# Altium project IOExpand.PrjPCB
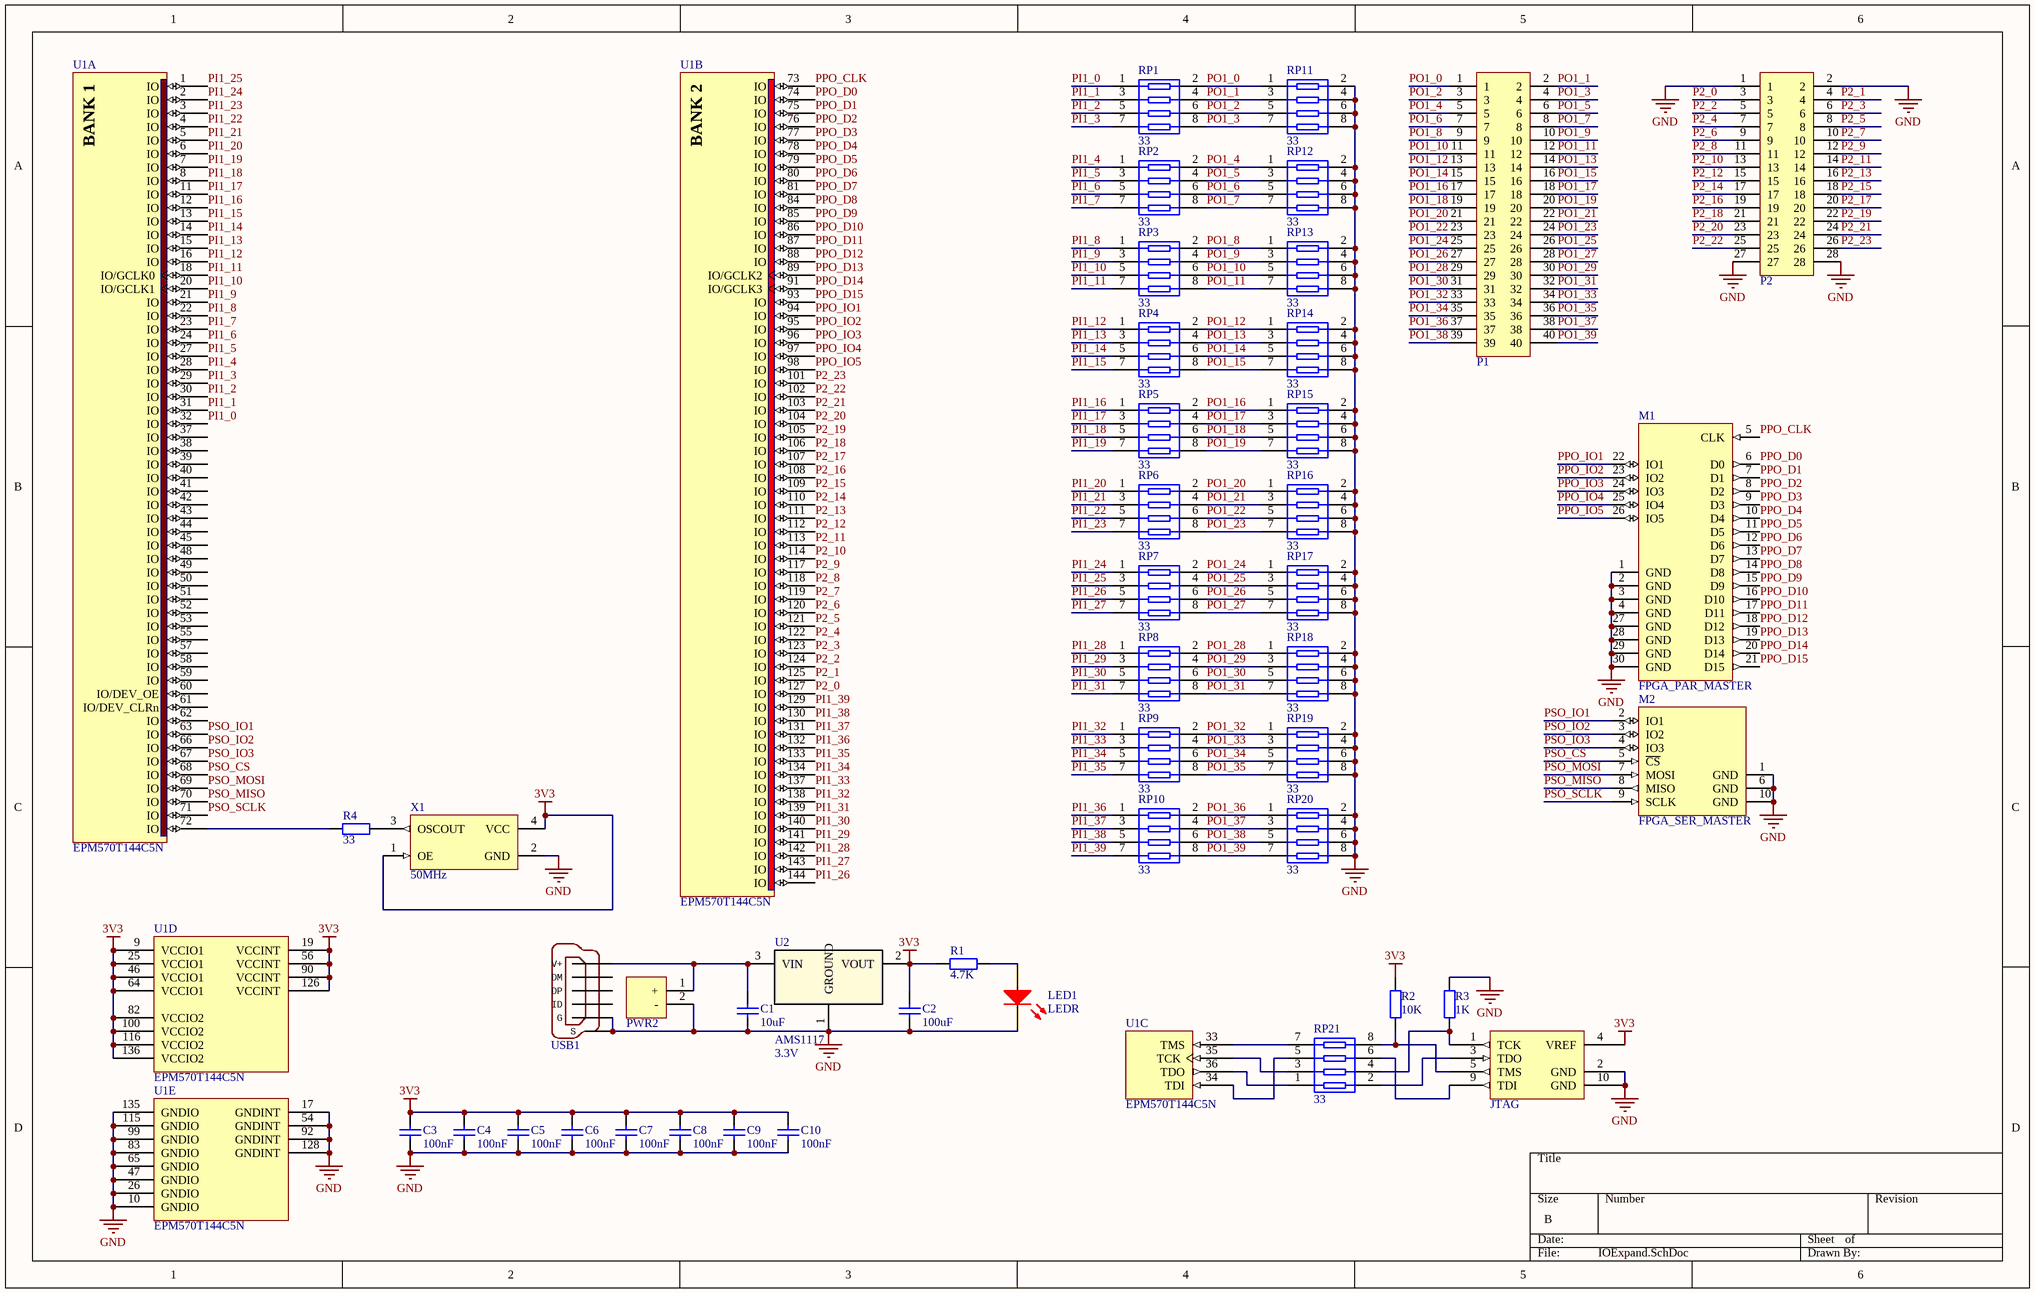
[diagram p0: IOExpand.SchDoc]
1 sheet, 46 parts. Net scope: global (net labels, ports and power ports of the same name join across sheets).
Board file: IOExpand.PcbDoc

## Sheet IOExpand.SchDoc
size B

### Parts
C1  value 10uF  [0805C]  (hidden comment: MLCC)
C2  value 100uF  [1206C]  (hidden comment: MLCC)
C3  value 100nF  [0603C]  (hidden comment: MLCC)
C4  value 100nF  [0603C]  (hidden comment: MLCC)
C5  value 100nF  [0603C]  (hidden comment: MLCC)
C6  value 100nF  [0603C]  (hidden comment: MLCC)
C7  value 100nF  [0603C]  (hidden comment: MLCC)
C8  value 100nF  [0603C]  (hidden comment: MLCC)
C9  value 100nF  [0603C]  (hidden comment: MLCC)
C10  value 100nF  [0603C]  (hidden comment: MLCC)
JTAG  JTAG_ALTERA  [JTAG10]  (value not drawn)
LED1  LEDR  [LED1206R]
M1  FPGA_PAR_MASTER  [IDC30]
M2  FPGA_SER_MASTER  [IDC10]
P1  Dual 20 pin port  [201S2X20]  (value not drawn)
P2  Dual 14 pin port  [201S2X14]  (value not drawn)
PWR2  WPORT2_PWR  [VH3.96-POWER-2P]  (value not drawn)
R1  value 4.7K  [0603R]  (hidden comment: Resistor)
R2  value 10K  [0603R]  (hidden comment: Resistor)
R3  value 1K  [0603R]  (hidden comment: Resistor)
R4  value 33  [0603R]  (hidden comment: Resistor)
RP1  value 33  [8P4R_0603]  (hidden comment: Res Pack)
RP2  value 33  [8P4R_0603]  (hidden comment: Res Pack)
RP3  value 33  [8P4R_0603]  (hidden comment: Res Pack)
RP4  value 33  [8P4R_0603]  (hidden comment: Res Pack)
RP5  value 33  [8P4R_0603]  (hidden comment: Res Pack)
RP6  value 33  [8P4R_0603]  (hidden comment: Res Pack)
RP7  value 33  [8P4R_0603]  (hidden comment: Res Pack)
RP8  value 33  [8P4R_0603]  (hidden comment: Res Pack)
RP9  value 33  [8P4R_0603]  (hidden comment: Res Pack)
RP10  value 33  [8P4R_0603]  (hidden comment: Res Pack)
RP11  value 33  [8P4R_0603]  (hidden comment: Res Pack)
RP12  value 33  [8P4R_0603]  (hidden comment: Res Pack)
RP13  value 33  [8P4R_0603]  (hidden comment: Res Pack)
RP14  value 33  [8P4R_0603]  (hidden comment: Res Pack)
RP15  value 33  [8P4R_0603]  (hidden comment: Res Pack)
RP16  value 33  [8P4R_0603]  (hidden comment: Res Pack)
RP17  value 33  [8P4R_0603]  (hidden comment: Res Pack)
RP18  value 33  [8P4R_0603]  (hidden comment: Res Pack)
RP19  value 33  [8P4R_0603]  (hidden comment: Res Pack)
RP20  value 33  [8P4R_0603]  (hidden comment: Res Pack)
RP21  value 33  [8P4R_0603]  (hidden comment: Res Pack)
U1  EPM570T144C5N  [TQFP144_N]  (parts A,B,C,D,E of 5)
U2  AMS1117  value 3.3V  [DCY4]
USB1  MICRO-USB  [USB-MICRO]  (value not drawn)
X1  value 50MHz  [XTAL-3225]  (hidden comment: Oscillator)

### Nets
3V3: C2.2 C3.2 C4.2 C5.2 C6.2 C7.2 C8.2 C9.2 C10.2 JTAG.4(VREF) R1.1 R2.2 U1.9(VCCIO1) U1.19(VCCINT) U1.25(VCCIO1) U1.46(VCCIO1) U1.56(VCCINT) U1.64(VCCIO1) U1.82(VCCIO2) U1.90(VCCINT) U1.100(VCCIO2) U1.116(VCCIO2) U1.126(VCCINT) U1.136(VCCIO2) U2.2(VOUT) X1.1(OE) X1.4(VCC)
GND: C1.1 C2.1 C3.1 C4.1 C5.1 C6.1 C7.1 C8.1 C9.1 C10.1 JTAG.2(GND) JTAG.10(GND) LED1.2(K) M1.1(GND) M1.2(GND) M1.3(GND) M1.4(GND) M1.27(GND) M1.28(GND) M1.29(GND) M1.30(GND) M2.1(GND) M2.6(GND) M2.10(GND) P2.1 P2.2 P2.27 P2.28 PWR2.2(-) R3.2 RP11.2 RP11.4 RP11.6 RP11.8 RP12.2 RP12.4 RP12.6 RP12.8 RP13.2 RP13.4 RP13.6 RP13.8 RP14.2 RP14.4 RP14.6 RP14.8 RP15.2 RP15.4 RP15.6 RP15.8 RP16.2 RP16.4 RP16.6 RP16.8 RP17.2 RP17.4 RP17.6 RP17.8 RP18.2 RP18.4 RP18.6 RP18.8 RP19.2 RP19.4 RP19.6 RP19.8 RP20.2 RP20.4 RP20.6 RP20.8 U1.10(GNDIO) U1.17(GNDINT) U1.26(GNDIO) U1.47(GNDIO) U1.54(GNDINT) U1.65(GNDIO) U1.83(GNDIO) U1.92(GNDINT) U1.99(GNDIO) U1.115(GNDIO) U1.128(GNDINT) U1.135(GNDIO) U2.1(GROUND) USB1.1(G) USB1.6(S) X1.2(GND)
P2_0: P2.3 U1.127(IO)
P2_1: P2.4 U1.125(IO)
P2_2: P2.5 U1.124(IO)
P2_3: P2.6 U1.123(IO)
P2_4: P2.7 U1.122(IO)
P2_5: P2.8 U1.121(IO)
P2_6: P2.9 U1.120(IO)
P2_7: P2.10 U1.119(IO)
P2_8: P2.11 U1.118(IO)
P2_9: P2.12 U1.117(IO)
P2_10: P2.13 U1.114(IO)
P2_11: P2.14 U1.113(IO)
P2_12: P2.15 U1.112(IO)
P2_13: P2.16 U1.111(IO)
P2_14: P2.17 U1.110(IO)
P2_15: P2.18 U1.109(IO)
P2_16: P2.19 U1.108(IO)
P2_17: P2.20 U1.107(IO)
P2_18: P2.21 U1.106(IO)
P2_19: P2.22 U1.105(IO)
P2_20: P2.23 U1.104(IO)
P2_21: P2.24 U1.103(IO)
P2_22: P2.25 U1.102(IO)
P2_23: P2.26 U1.101(IO)
PI1_0: RP1.1 U1.32(IO)
PI1_1: RP1.3 U1.31(IO)
PI1_2: RP1.5 U1.30(IO)
PI1_3: RP1.7 U1.29(IO)
PI1_4: RP2.1 U1.28(IO)
PI1_5: RP2.3 U1.27(IO)
PI1_6: RP2.5 U1.24(IO)
PI1_7: RP2.7 U1.23(IO)
PI1_8: RP3.1 U1.22(IO)
PI1_9: RP3.3 U1.21(IO)
PI1_10: RP3.5 U1.20(IO/GCLK1)
PI1_11: RP3.7 U1.18(IO/GCLK0)
PI1_12: RP4.1 U1.16(IO)
PI1_13: RP4.3 U1.15(IO)
PI1_14: RP4.5 U1.14(IO)
PI1_15: RP4.7 U1.13(IO)
PI1_16: RP5.1 U1.12(IO)
PI1_17: RP5.3 U1.11(IO)
PI1_18: RP5.5 U1.8(IO)
PI1_19: RP5.7 U1.7(IO)
PI1_20: RP6.1 U1.6(IO)
PI1_21: RP6.3 U1.5(IO)
PI1_22: RP6.5 U1.4(IO)
PI1_23: RP6.7 U1.3(IO)
PI1_24: RP7.1 U1.2(IO)
PI1_25: RP7.3 U1.1(IO)
PI1_26: RP7.5 U1.144(IO)
PI1_27: RP7.7 U1.143(IO)
PI1_28: RP8.1 U1.142(IO)
PI1_29: RP8.3 U1.141(IO)
PI1_30: RP8.5 U1.140(IO)
PI1_31: RP8.7 U1.139(IO)
PI1_32: RP9.1 U1.138(IO)
PI1_33: RP9.3 U1.137(IO)
PI1_34: RP9.5 U1.134(IO)
PI1_35: RP9.7 U1.133(IO)
PI1_36: RP10.1 U1.132(IO)
PI1_37: RP10.3 U1.131(IO)
PI1_38: RP10.5 U1.130(IO)
PI1_39: RP10.7 U1.129(IO)
PO1_0: P1.1 RP1.2 RP11.1
PO1_1: P1.2 RP1.4 RP11.3
PO1_2: P1.3 RP1.6 RP11.5
PO1_3: P1.4 RP1.8 RP11.7
PO1_4: P1.5 RP2.2 RP12.1
PO1_5: P1.6 RP2.4 RP12.3
PO1_6: P1.7 RP2.6 RP12.5
PO1_7: P1.8 RP2.8 RP12.7
PO1_8: P1.9 RP3.2 RP13.1
PO1_9: P1.10 RP3.4 RP13.3
PO1_10: P1.11 RP3.6 RP13.5
PO1_11: P1.12 RP3.8 RP13.7
PO1_12: P1.13 RP4.2 RP14.1
PO1_13: P1.14 RP4.4 RP14.3
PO1_14: P1.15 RP4.6 RP14.5
PO1_15: P1.16 RP4.8 RP14.7
PO1_16: P1.17 RP5.2 RP15.1
PO1_17: P1.18 RP5.4 RP15.3
PO1_18: P1.19 RP5.6 RP15.5
PO1_19: P1.20 RP5.8 RP15.7
PO1_20: P1.21 RP6.2 RP16.1
PO1_21: P1.22 RP6.4 RP16.3
PO1_22: P1.23 RP6.6 RP16.5
PO1_23: P1.24 RP6.8 RP16.7
PO1_24: P1.25 RP7.2 RP17.1
PO1_25: P1.26 RP7.4 RP17.3
PO1_26: P1.27 RP7.6 RP17.5
PO1_27: P1.28 RP7.8 RP17.7
PO1_28: P1.29 RP8.2 RP18.1
PO1_29: P1.30 RP8.4 RP18.3
PO1_30: P1.31 RP8.6 RP18.5
PO1_31: P1.32 RP8.8 RP18.7
PO1_32: P1.33 RP9.2 RP19.1
PO1_33: P1.34 RP9.4 RP19.3
PO1_34: P1.35 RP9.6 RP19.5
PO1_35: P1.36 RP9.8 RP19.7
PO1_36: P1.37 RP10.2 RP20.1
PO1_37: P1.38 RP10.4 RP20.3
PO1_38: P1.39 RP10.6 RP20.5
PO1_39: P1.40 RP10.8 RP20.7
PPO_CLK: M1.5(CLK) U1.73(IO)
PPO_D0: M1.6(D0) U1.74(IO)
PPO_D1: M1.7(D1) U1.75(IO)
PPO_D2: M1.8(D2) U1.76(IO)
PPO_D3: M1.9(D3) U1.77(IO)
PPO_D4: M1.10(D4) U1.78(IO)
PPO_D5: M1.11(D5) U1.79(IO)
PPO_D6: M1.12(D6) U1.80(IO)
PPO_D7: M1.13(D7) U1.81(IO)
PPO_D8: M1.14(D8) U1.84(IO)
PPO_D9: M1.15(D9) U1.85(IO)
PPO_D10: M1.16(D10) U1.86(IO)
PPO_D11: M1.17(D11) U1.87(IO)
PPO_D12: M1.18(D12) U1.88(IO)
PPO_D13: M1.19(D13) U1.89(IO/GCLK2)
PPO_D14: M1.20(D14) U1.91(IO/GCLK3)
PPO_D15: M1.21(D15) U1.93(IO)
PPO_IO1: M1.22(IO1) U1.94(IO)
PPO_IO2: M1.23(IO2) U1.95(IO)
PPO_IO3: M1.24(IO3) U1.96(IO)
PPO_IO4: M1.25(IO4) U1.97(IO)
PPO_IO5: M1.26(IO5) U1.98(IO)
PSO_CS: M2.5(~{CS}) U1.68(IO)
PSO_IO1: M2.2(IO1) U1.63(IO)
PSO_IO2: M2.3(IO2) U1.66(IO)
PSO_IO3: M2.4(IO3) U1.67(IO)
PSO_MISO: M2.8(MISO) U1.70(IO)
PSO_MOSI: M2.7(MOSI) U1.69(IO)
PSO_SCLK: M2.9(SCLK) U1.71(IO)
NetC1_2: C1.2 PWR2.1(+) U2.3(VIN) USB1.5(V+)
NetJTAG_1: JTAG.1(TCK) R3.1 RP21.4
NetJTAG_3: JTAG.3(TDO) RP21.2
NetJTAG_5: JTAG.5(TMS) R2.1 RP21.8
NetJTAG_9: JTAG.9(TDI) RP21.6
NetLED1_1: LED1.1(A) R1.2
NetR4_1: R4.1 U1.72(IO)
NetR4_2: R4.2 X1.3(OSCOUT)
NetRP21_1: RP21.1 U1.36(TDO)
NetRP21_3: RP21.3 U1.35(TCK)
NetRP21_5: RP21.5 U1.34(TDI)
NetRP21_7: RP21.7 U1.33(TMS)

Not connected (* = marked no-connect by the designer): U1 37(IO) 38(IO) 39(IO) 40(IO) 41(IO) 42(IO) 43(IO) 44(IO) 45(IO) 48(IO) 49(IO) 50(IO) 51(IO) 52(IO) 53(IO) 55(IO) 57(IO) 58(IO) 59(IO) 60(IO/DEV_OE) 61(IO/DEV_CLRn) 62(IO); USB1 2(ID) 3(DP) 4(DM)

### Notes on the sheet
- (in symbol EPM570T144C5N, part A) BANK 1
- (in symbol EPM570T144C5N, part B) BANK 2

### Library data of the parts
JTAG = JTAG_ALTERA: ALTERA JTAG port
LED1 = LEDR: RED LED
M1 = FPGA_PAR_MASTER: FPGA parallel port
M2 = FPGA_SER_MASTER: FPGA serial port
P1 = DPORT20
P2 = DPORT14
PWR2 = WPORT2_PWR: 2 pin power port
RP1-RP21 = Res Pack: Isolated Resistor Network
U1 = EPM570T144C5N: MAX II 3.3/2.5V CPLD, 116 IOs, 570 Logic Elements, 144-Pin Plastic TQFP, Commercial Temperature, Speed Grade 5, Pb-Free; Note: Each set of VCCIO pins can be connected to 3.3V, 2.5V, 1.8V, or 1.5V.; Note: All VCCINT pins must be connected to either 3.3V or 2.5V (but not a combination of both).; DatasheetVersion: ver1.8, Jul-2006; PackageVersion: ver16.3, Dec-2010; PackageReference: TQFP144; PackageDescription: 144-Pin Plastic Thin Quad Flat Pack (TQFP144) - Wire Bond; Code_JEDEC: MS-026-BFB; ComponentLink1Description: Manufacturer URL; ComponentLink1URL: http://www.altera.com/; ComponentLink2Description: Handbook; ComponentLink2URL: http://www.altera.com/literature/hb/max2/max2_mii5v1.pdf; ComponentLink3Description: Package Specification; ComponentLink3URL: http://www.altera.com/literature/ds/dspkg.pdf
U2 = AMS1117: 800mA LOW DROPOUT VOLTAGE REGULATOR
USB1 = MICRO-USB: MICRO USB Connector